# Altium schematic sheet LPS_sch_Thermostat.SchDoc: Control Temperature board
size A4; DrawnBy: Léo-Paul Sablé; Revision: 1A; SheetNumber: 1; SheetTotal: 1
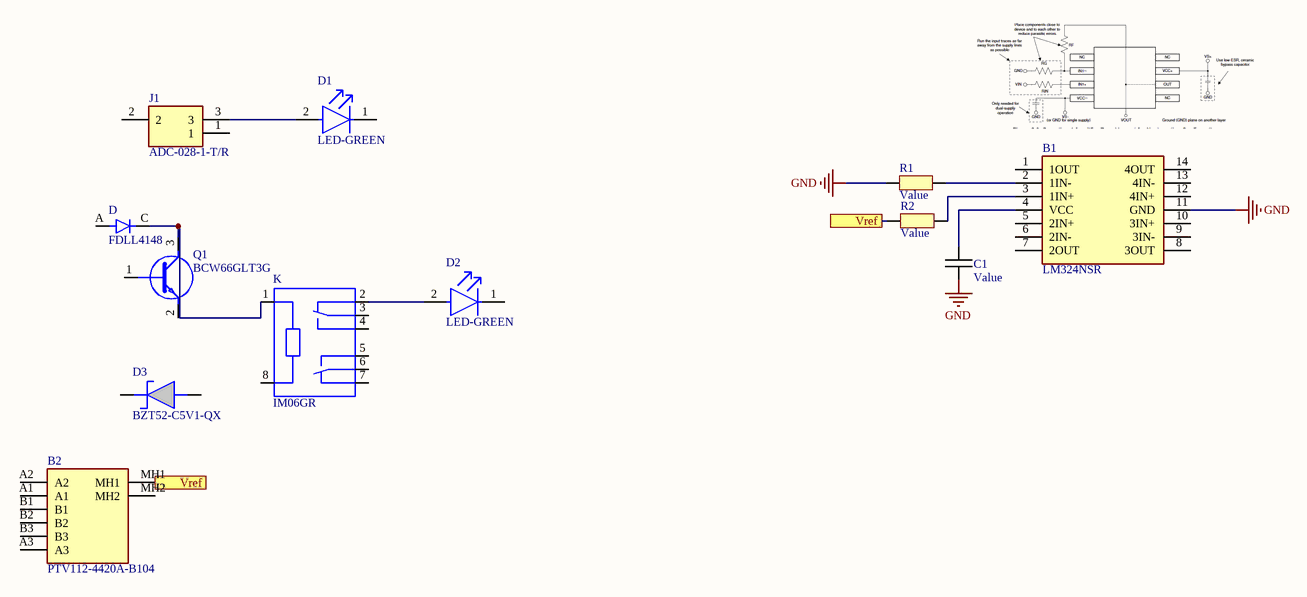
[diagram p0: LPS_sch_Thermostat.SchDoc]

## Parts
B1  LM324NSR  [SOIC127P780X200-14N]
B2  PTV112-4420A-B104  [PTV1124420AB104]
C1  Value  [CAPC1005X06N]
D  FDLL4148  [DIOMELF3414N]
D1  LED-GREEN  [SMD-1608-LED]
D2  LED-GREEN  [SMD-1608-LED]
D3  BZT52-C5V1-QX  [SOD3616X130N]
J1  ADC-028-1-T/R  [PJ1021SMTTR]
K  IM06GR  [RELAY_IM06GR]
Q1  BCW66GLT3G  [SOT96P237X111-3N]
R1  Value  [RESC1005X06N]
R2  Value  [RESC1005X06N]

## Ports
Vref

## Nets
GND: B1.11(GND) C1.2 R1.1
Vref: B2.MH1 R2.1 ; port Vref
NetB1_2: B1.2(1IN-) R1.2
NetB1_3: B1.3(1IN+) R2.2
NetB1_4: B1.4(VCC) C1.1
NetD1_2: D1.2(A) J1.3
NetD2_2: D2.2(A) K.2
NetD_C: D.C K.1 Q1.3(C)

Not connected (* = marked no-connect by the designer): B1 1(1OUT) 5(2IN+) 6(2IN-) 7(2OUT) 8(3OUT) 9(3IN-) 10(3IN+) 12(4IN+) 13(4IN-) 14(4OUT); B2 A1 A2 A3 B1 B2 B3 MH2; D A; D1 1(C); D2 1(C); D3 1(K) 2(A); J1 1 2; K 3 4 5 6 7 8; Q1 1(B) 2(E)

## Library data of the parts
B1 = LM324NSR: Quadruple Operational Amplifier; Manufacturer_Name: Texas Instruments; Geometry.Height: 2mm; Manufacturer_Part_Number: LM324NSR; Mouser Part Number: 595-LM324NSR; Mouser Price/Stock: https://www.mouser.co.uk/ProductDetail/Texas-Instruments/LM324NSR?qs=VBduBm9rCJQcjq4eh95DkA%3D%3D; Arrow Part Number: LM324NSR; Arrow Price/Stock: https://www.arrow.com/en/products/lm324nsr/texas-instruments?utm_currency=USD&region=nac; Datasheet Link: http://www.ti.com/lit/gpn/LM324
B2 = PTV112-4420A-B104: Potentiometers PANEL CONTROL 100kOhm; Manufacturer_Name: Bourns; Geometry.Height: 20.5mm; Manufacturer_Part_Number: PTV112-4420A-B104; Mouser Part Number: 652-PTV1124420AB104; Mouser Price/Stock: https://www.mouser.co.uk/ProductDetail/Bourns/PTV112-4420A-B104?qs=nqw9FAyaR8PT4wHHFlLdhA%3D%3D; Arrow Part Number: *; Arrow Price/Stock: *; Datasheet Link: https://www.bourns.com/docs/Product-Datasheets/PTVPTT.pdf
C1 = Capacitor
D = FDLL4148: Diode Standard 100V 200mA Surface Mount SOD-80; MF: ON Semiconductor; MP: FDLL4148; SnapEDA_Link: https://www.snapeda.com/parts/FDLL4148/ON%20Semiconductor/view-part/2783433/?ref=snap; Package: SOD-80-2 ON Semiconductor; DigiKey-Purchase-URL: https://snapeda.com/shop?store=DigiKey&id=2783433; Value: *; Mouser-Purchase-URL: https://snapeda.com/shop?store=Mouser&id=2783433; Digi-Key_Part_Number: FDLL4148CT-ND
D1 D2 = LED-GREEN: LED GREEN CLEAR CHIP SMD LTST-C190GKT; Dominant Wavelength: 569nm; Reverse Voltage: 5V; Lens Color: Colorless; Viewing Angle: 130°; Voltage: 2V; Forward Current: 30mA; Power Dissipation: 100mW; Luminous Intensity: 6mcd; Number of LEDs: 1; Forward Voltage: 2.1V; Wavelength: 565nm; Test Current: 10mA; Min Operating Temperature: -55°C; Lens Style: Clear; Mount: Surface Mount; Width: 0.8mm; Packaging: Tape and Reel; Lens Transparency: Clear; Case Code (Metric): 1608; Depth: 0.8mm; Case Code (Imperial): 0603; Case/Package: 0603; Number of Pins: 2; Max Operating Temperature: 85°C; Lead Free: Lead Free; Number of Elements: 1; Length: 1.6mm; Height: 0.8mm; Package Quantity: 1; Power Rating: 100mW; Radiation Hardening: No; Illumination Color: Green; Color: Green
D3 = BZT52-C5V1-QX: BZT52-Q series - Voltage regulator diodes@en-us; Manufacturer_Name: Nexperia; Geometry.Height: 1.3mm; Manufacturer_Part_Number: BZT52-C5V1-QX; Mouser Part Number: 771-BZT52-C5V1-QX; Mouser Price/Stock: https://www.mouser.co.uk/ProductDetail/Nexperia/BZT52-C5V1-QX?qs=rQFj71Wb1eWpKfJh0U4RGA%3D%3D; Arrow Part Number: *; Arrow Price/Stock: *; Datasheet Link: https://assets.nexperia.com/documents/data-sheet/BZT52-Q_SER.pdf
J1 = ADC-028-1-T/R: Connecteurs d'alimentation continue DC POWER JACK 2MM PIN TYPE 028; Manufacturer_Name: Same Sky; Geometry.Height: 6mm; Manufacturer_Part_Number: ADC-028-1-T/R; Mouser Part Number: 737-ADC-028-1-T/R; Mouser Price/Stock: https://www.mouser.fr/ProductDetail/Adam-Tech/ADC-028-1-T-R?qs=TTVbHWoAP%2FSiqsZeR9Co0Q%3D%3D
K = IM06GR: Electromechanical Relay 12VDC 1.029KOhm 2A DPDT _10x7.5x5.65_mm SMD Signal Relay; MF: TE Connectivity; Package: None; Availability: Unavailable; TE_purchase_URL: https://www.te.com/usa-en/product-2-1462037-3.html?te_bu=Cor&te_type=disp&te_campaign=seda_glo_cor-seda-global-disp-prtnr-fy19-seda-model-bom-cta_sma-317_1&elqCampaignId=32493; Value: *; MP: IM06GR; SnapEDA_Link: https://www.snapeda.com/parts/IM06GR/TE%20Connectivity%20Potter%20%26%20Brumfield%20Relays/view-part/264147/?ref=snap; Price: None
Q1 = BCW66GLT3G: NPN Bipolar Transistor; Manufacturer_Name: onsemi; Geometry.Height: 1.11mm; Manufacturer_Part_Number: BCW66GLT3G; Mouser Part Number: 863-BCW66GLT3G; Mouser Price/Stock: https://www.mouser.co.uk/ProductDetail/onsemi/BCW66GLT3G?qs=XfkxeqX9xWXeTiewInI3Nw%3D%3D; Arrow Part Number: BCW66GLT3G; Arrow Price/Stock: https://www.arrow.com/en/products/bcw66glt3g/on-semiconductor?region=europe; Datasheet Link: http://www.onsemi.com/pub/Collateral/BCW66GLT1-D.PDF
R1 R2 = Resistor